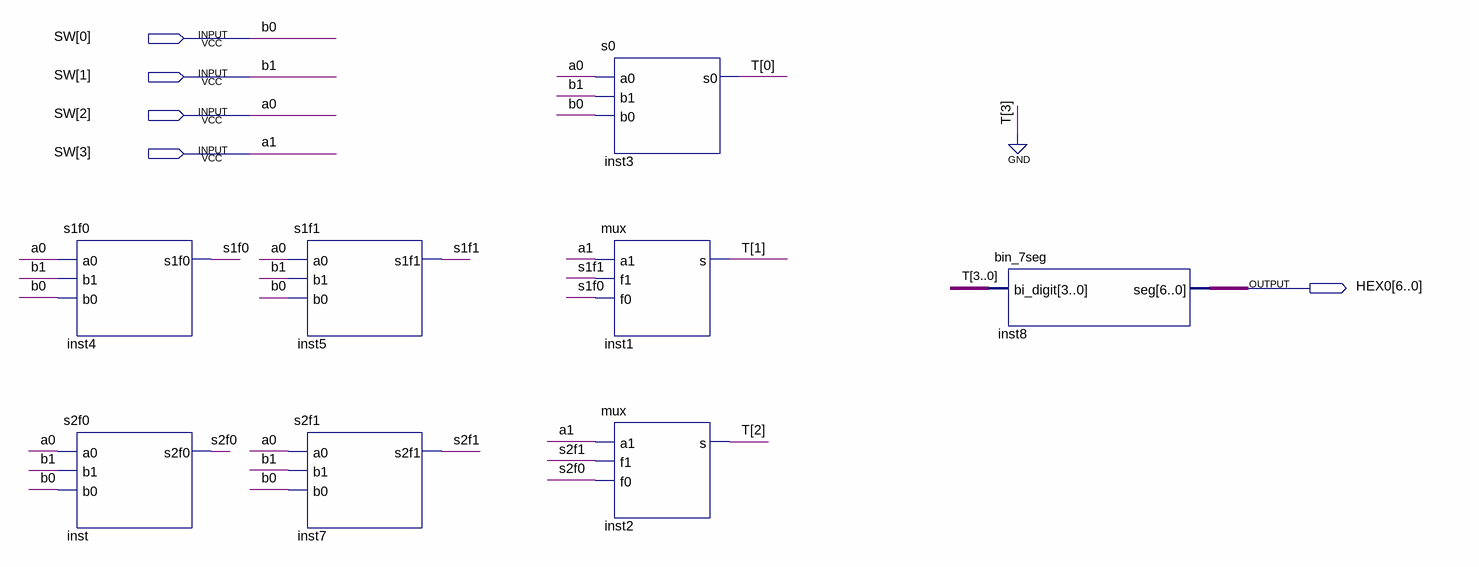
[diagram p0: schematic sheet]
// Quartus schematic Lab4.bdf as structural Verilog: 8 symbols, 5 pins
module Lab4 (
  input  [3:0] SW,
  output [6:0] HEX0
);

  wire s1f0, s1f1, s2f0, s2f1;
  wire [2:0] T;

  s1f0 inst4 (.a0(SW[2]), .b1(SW[1]), .b0(SW[0]), .s1f0(s1f0));
  s2f0 inst (.a0(SW[2]), .b1(SW[1]), .b0(SW[0]), .s2f0(s2f0));
  s1f1 inst5 (.a0(SW[2]), .b1(SW[1]), .b0(SW[0]), .s1f1(s1f1));
  s2f1 inst7 (.a0(SW[2]), .b1(SW[1]), .b0(SW[0]), .s2f1(s2f1));
  s0 inst3 (.a0(SW[2]), .b1(SW[1]), .b0(SW[0]), .s0(T[0]));
  mux inst1 (.a1(SW[3]), .f1(s1f1), .f0(s1f0), .s(T[1]));
  mux inst2 (.a1(SW[3]), .f1(s2f1), .f0(s2f0), .s(T[2]));
  bin_7seg inst8 (.bi_digit({1'b0, T}), .seg(HEX0));

  // Other names for the same wires on the sheet: a0 = SW[2]; a1 = SW[3]; b0 = SW[0]; b1 = SW[1]
endmodule
